# Altium schematic sheet Sch_Power.SchDoc
size A; SheetNumber: 1; SheetTotal: 1
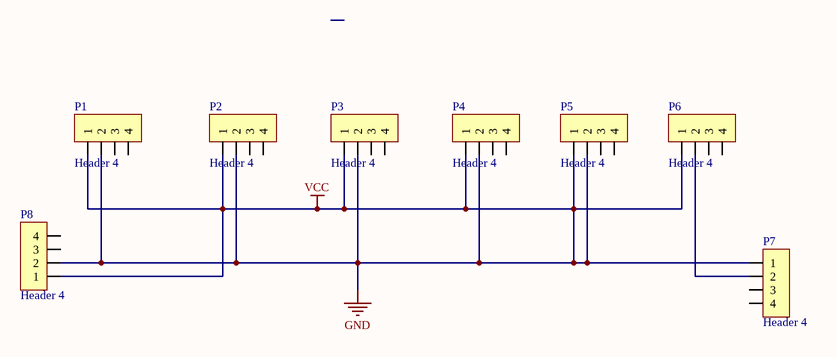
[diagram p0: Sch_Power.SchDoc]

## Parts
P1  Header 4  [HDR/Header/4/BOX/SMD]
P2  Header 4  [HDR/Header/4/BOX/SMD]
P3  Header 4  [HDR/Header/4/BOX/SMD]
P4  Header 4  [HDR/Header/4/BOX/SMD]
P5  Header 4  [HDR/Header/4/BOX/SMD]
P6  Header 4  [HDR/Header/4/BOX/SMD]
P7  Header 4  [HDR/Header/4/BOX/SMD]
P8  Header 4  [HDR/Header/4/BOX/SMD]

## Nets
GND: P1.1 P1.2 P2.1 P2.2 P3.1 P3.2 P4.1 P4.2 P5.1 P5.2 P6.1 P7.1 P8.1 P8.2  [also labelled VCC]
NetP6_2: P6.2 P7.2

Not connected (* = marked no-connect by the designer): P1 3 4; P2 3 4; P3 3 4; P4 3 4; P5 3 4; P6 3 4; P7 3 4; P8 3 4

## Library data of the parts
P1-P8 = Header 4: Header, 4-Pin